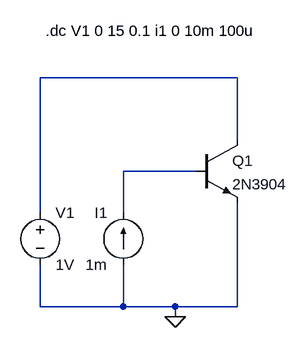
[diagram p0: schematic LT_QUALIF_2N3904.asc]
LT_QUALIF_2N3904.asc, the LTspice schematic file:
Version 4
SHEET 1 1564 2292
WIRE 432 160 128 160
WIRE 432 256 432 160
WIRE 368 304 256 304
WIRE 128 368 128 160
WIRE 256 368 256 304
WIRE 128 512 128 448
WIRE 256 512 256 448
WIRE 256 512 128 512
WIRE 336 512 256 512
WIRE 432 512 432 352
WIRE 432 512 336 512
WIRE 336 528 336 512
FLAG 336 528 0
SYMBOL /npn 368 256 R0
SYMATTR InstName Q1
SYMATTR Value 2N3904
SYMBOL /voltage 128 352 R0
SYMATTR InstName V1
SYMATTR Value 1V
SYMBOL /current 256 448 R180
WINDOW 0 24 80 Left 2
WINDOW 3 24 0 Left 2
WINDOW 123 0 0 Left 0
WINDOW 39 0 0 Left 0
SYMATTR InstName I1
SYMATTR Value 1m
TEXT 136 88 Left 2 !.dc V1 0 15 0.1 i1 0 10m 100u

The netlist it stands for:
* LT_QUALIF_2N3904.asc
Q1 N001 N002 0 0 2N3904
V1 N001 0 1V
I1 0 N002 1m
.model NPN NPN
.model PNP PNP
.lib standard.bjt
.dc V1 0 15 0.1 i1 0 10m 100u
.backanno
.end